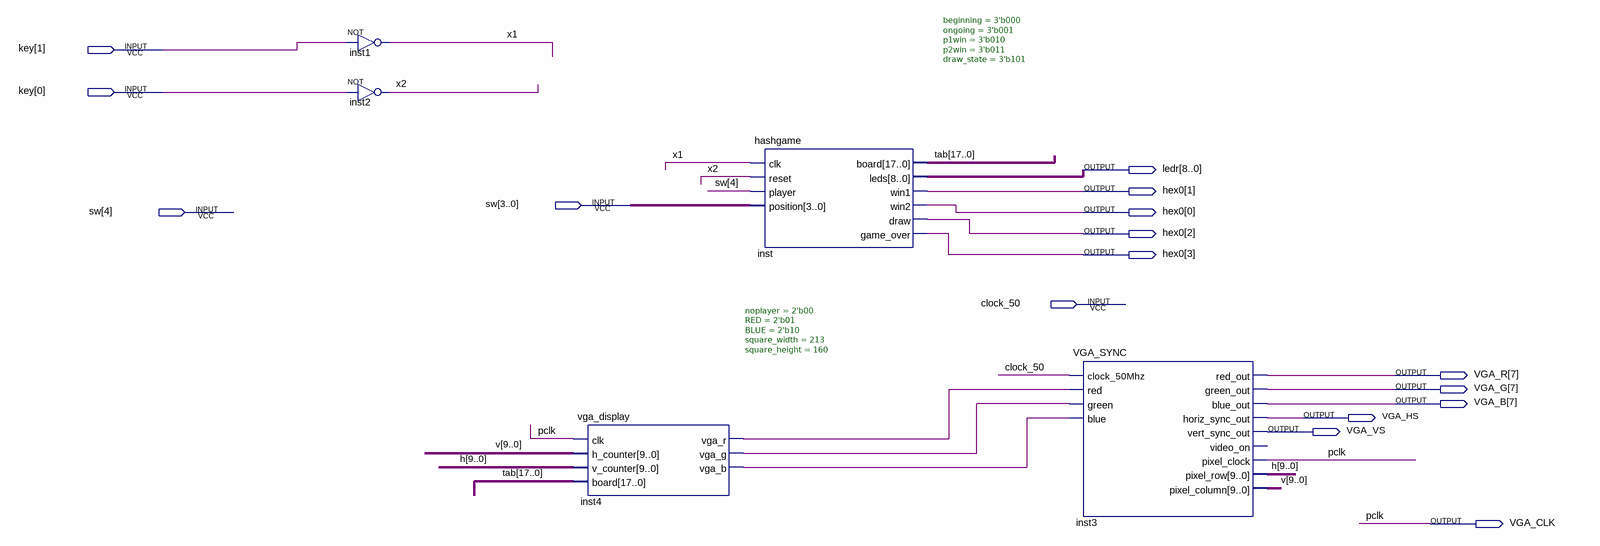
[diagram p0: schematic sheet]
// Quartus schematic hashgame_block.bdf as structural Verilog: 5 symbols, 16 pins
module hashgame_block (
  input  [1:0] key,
  input  [4:0] sw,
  input  clock_50,
  output [8:0] ledr,
  output [3:0] hex0,
  output [7:7] VGA_R,
  output [7:7] VGA_G,
  output [7:7] VGA_B,
  output VGA_HS,
  output VGA_VS,
  output VGA_CLK
);

  wire inst4_vga_b, inst4_vga_g, inst4_vga_r, x1, x2;
  wire [9:0] h, v;
  wire [17:0] tab;

  not inst1 (x1, key[1]);
  not inst2 (x2, key[0]);
  vga_display #(.noplayer(2'b00), .RED(2'b01), .BLUE(2'b10), .square_width(213), .square_height(160)) inst4 (
    .clk(VGA_CLK), .h_counter(v), .v_counter(h), .board(tab), .vga_r(inst4_vga_r), .vga_g(inst4_vga_g),
    .vga_b(inst4_vga_b));
  hashgame #(.beginning(3'b000), .ongoing(3'b001), .p1win(3'b010), .p2win(3'b011), .draw_state(3'b101)) inst (
    .clk(x1), .reset(x2), .player(sw[4]), .position(sw[3:0]), .board(tab), .leds(ledr), .win1(hex0[1]),
    .win2(hex0[0]), .draw(hex0[2]), .game_over(hex0[3]));
  VGA_SYNC inst3 (
    .clock_50Mhz(clock_50), .red(inst4_vga_r), .green(inst4_vga_g), .blue(inst4_vga_b), .red_out(VGA_R[7]),
    .green_out(VGA_G[7]), .blue_out(VGA_B[7]), .horiz_sync_out(VGA_HS), .vert_sync_out(VGA_VS),
    .pixel_clock(VGA_CLK), .pixel_row(h), .pixel_column(v));  // open: video_on

  // Other names for the same wires on the sheet: pclk = VGA_CLK
endmodule
